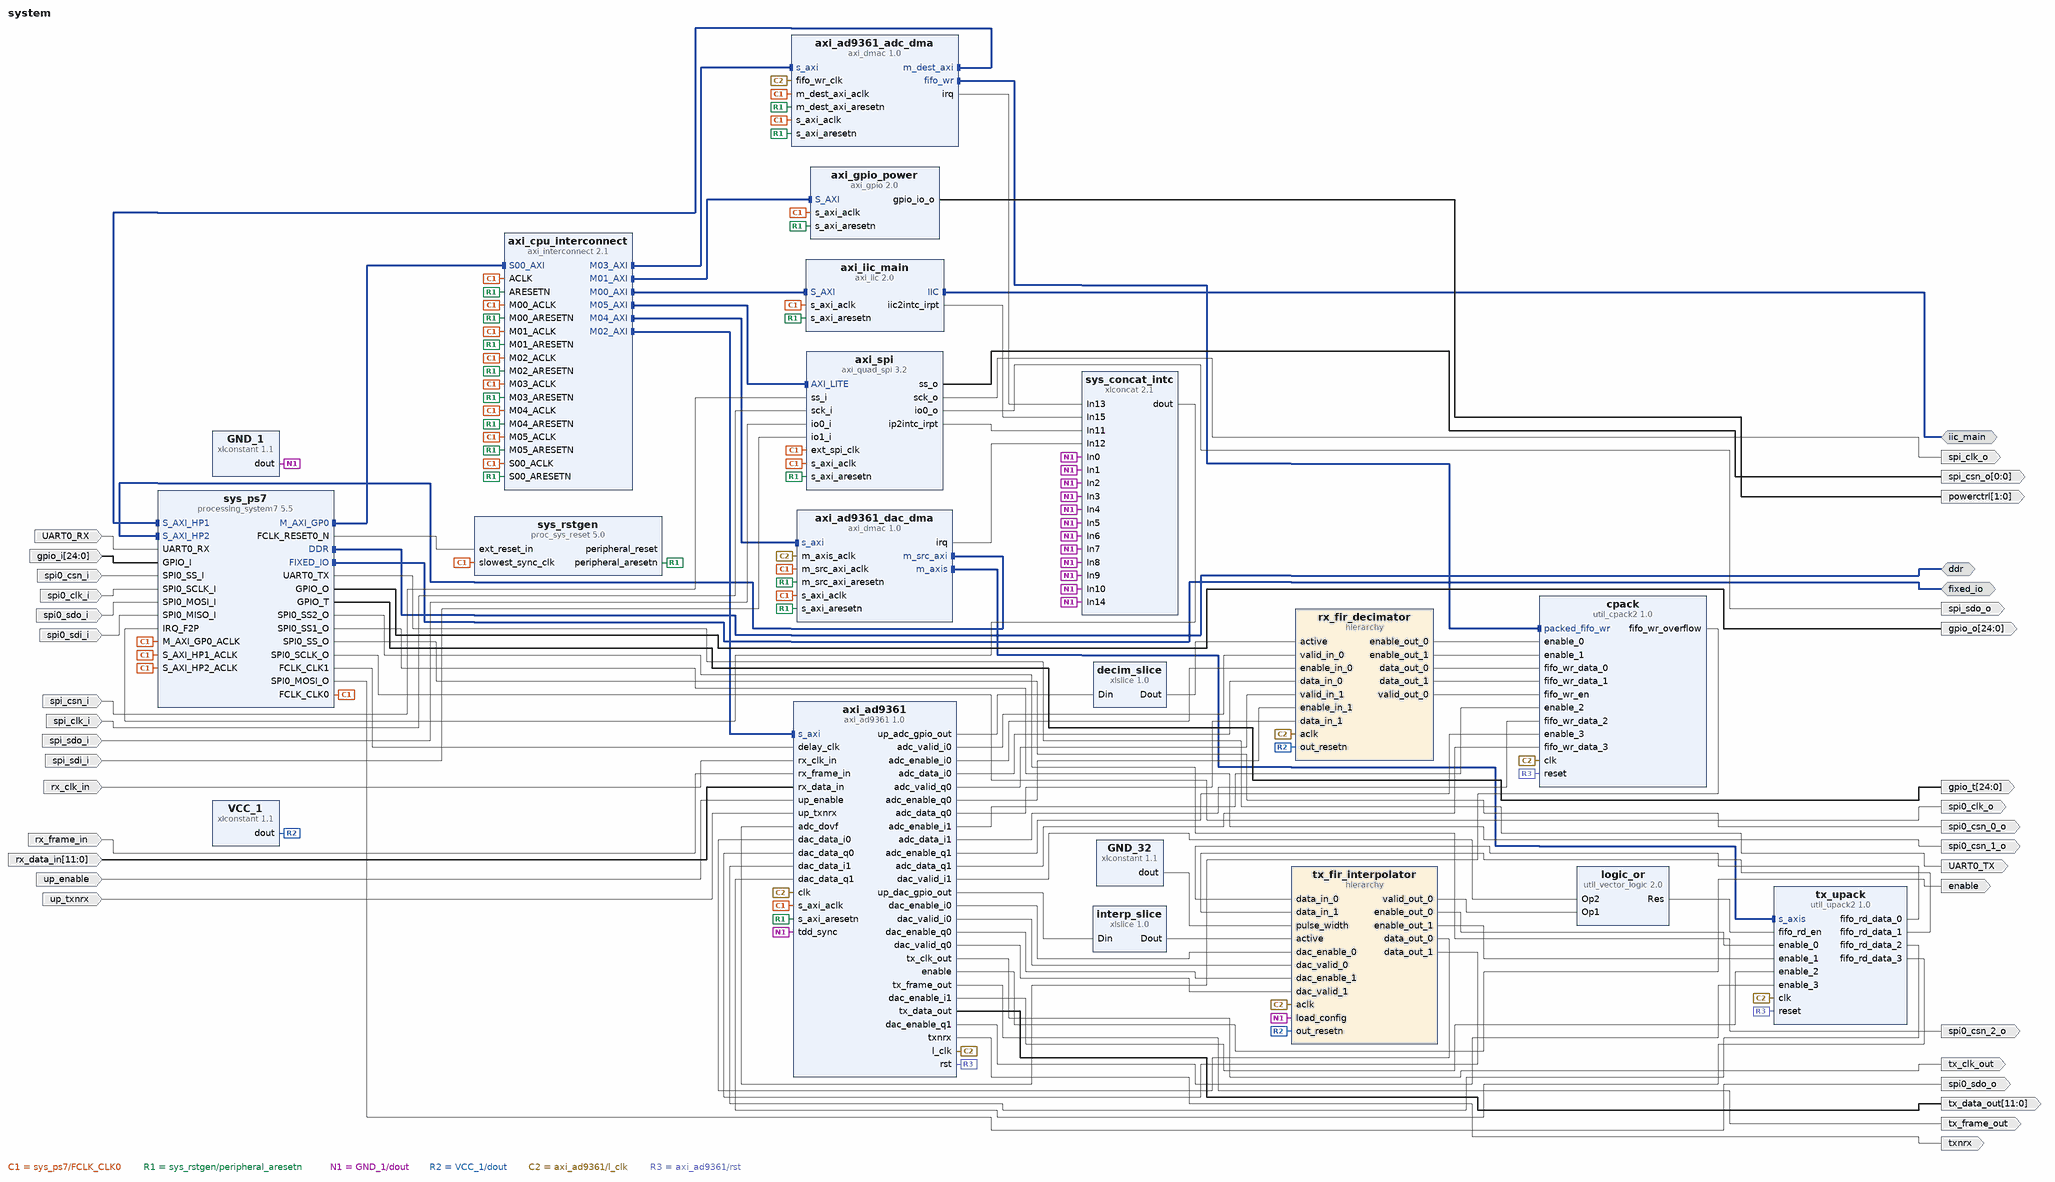
[diagram p0: block diagram of the top level]
# Vivado block design system, xc7z020clg400-2, Vivado 2019.1
create_bd_design system

create_bd_intf_port -mode Master -vlnv xilinx.com:interface:ddrx_rtl:1.0 ddr
create_bd_intf_port -mode Master -vlnv xilinx.com:display_processing_system7:fixedio_rtl:1.0 fixed_io
create_bd_intf_port -mode Master -vlnv xilinx.com:interface:iic_rtl:1.0 iic_main
create_bd_port -dir O UART0_TX
create_bd_port -dir I UART0_RX
create_bd_port -dir O spi0_csn_2_o
create_bd_port -dir O spi0_csn_1_o
create_bd_port -dir O spi0_csn_0_o
create_bd_port -dir I spi0_csn_i
create_bd_port -dir I spi0_clk_i
create_bd_port -dir O spi0_clk_o
create_bd_port -dir I spi0_sdo_i
create_bd_port -dir O spi0_sdo_o
create_bd_port -dir I spi0_sdi_i
create_bd_port -dir I -from 24 -to 0 gpio_i
create_bd_port -dir O -from 24 -to 0 gpio_o
create_bd_port -dir O -from 24 -to 0 gpio_t
create_bd_port -dir O -from 0 -to 0 spi_csn_o
create_bd_port -dir I spi_csn_i
create_bd_port -dir I spi_clk_i
create_bd_port -dir O spi_clk_o
create_bd_port -dir I spi_sdo_i
create_bd_port -dir O spi_sdo_o
create_bd_port -dir I spi_sdi_i
create_bd_port -dir I rx_clk_in
create_bd_port -dir I rx_frame_in
create_bd_port -dir I -from 11 -to 0 rx_data_in
create_bd_port -dir O tx_clk_out
create_bd_port -dir O tx_frame_out
create_bd_port -dir O -from 11 -to 0 tx_data_out
create_bd_port -dir O enable
create_bd_port -dir O txnrx
create_bd_port -dir I up_enable
create_bd_port -dir I up_txnrx
create_bd_port -dir O -from 1 -to 0 powerctrl

create_bd_cell -type ip -vlnv xilinx.com:ip:processing_system7:5.5 sys_ps7
set_property -dict [list \
  CONFIG.PCW_ENET0_ENET0_IO {MIO 16 .. 27} \
  CONFIG.PCW_ENET0_GRP_MDIO_ENABLE 1 \
  CONFIG.PCW_ENET0_GRP_MDIO_IO {MIO 52 .. 53} \
  CONFIG.PCW_ENET0_PERIPHERAL_ENABLE 1 \
  CONFIG.PCW_ENET0_RESET_ENABLE 1 \
  CONFIG.PCW_ENET0_RESET_IO {MIO 46} \
  CONFIG.PCW_ENET_RESET_ENABLE 1 \
  CONFIG.PCW_ENET_RESET_SELECT {Separate reset pins} \
  CONFIG.PCW_EN_CLK1_PORT 1 \
  CONFIG.PCW_EN_RST1_PORT 1 \
  CONFIG.PCW_FCLK_CLK1_BUF TRUE \
  CONFIG.PCW_FPGA0_PERIPHERAL_FREQMHZ 100.0 \
  CONFIG.PCW_FPGA1_PERIPHERAL_FREQMHZ 200.0 \
  CONFIG.PCW_FPGA_FCLK1_ENABLE 1 \
  CONFIG.PCW_GPIO_EMIO_GPIO_ENABLE 1 \
  CONFIG.PCW_GPIO_EMIO_GPIO_IO 25 \
  CONFIG.PCW_GPIO_EMIO_GPIO_WIDTH 25 \
  CONFIG.PCW_GPIO_MIO_GPIO_ENABLE 1 \
  CONFIG.PCW_GPIO_MIO_GPIO_IO MIO \
  CONFIG.PCW_I2C_RESET_ENABLE 1 \
  CONFIG.PCW_IRQ_F2P_INTR 1 \
  CONFIG.PCW_IRQ_F2P_MODE REVERSE \
  CONFIG.PCW_PRESET_BANK1_VOLTAGE {LVCMOS 1.8V} \
  CONFIG.PCW_QSPI_GRP_SINGLE_SS_ENABLE 1 \
  CONFIG.PCW_QSPI_GRP_SINGLE_SS_IO {MIO 1 .. 6} \
  CONFIG.PCW_QSPI_PERIPHERAL_ENABLE 1 \
  CONFIG.PCW_QSPI_QSPI_IO {MIO 1 .. 6} \
  CONFIG.PCW_SD0_GRP_CD_ENABLE 0 \
  CONFIG.PCW_SD0_GRP_WP_ENABLE 0 \
  CONFIG.PCW_SD0_PERIPHERAL_ENABLE 1 \
  CONFIG.PCW_SD0_SD0_IO {MIO 40 .. 45} \
  CONFIG.PCW_SDIO_PERIPHERAL_FREQMHZ 50 \
  CONFIG.PCW_SINGLE_QSPI_DATA_MODE x4 \
  CONFIG.PCW_SPI0_PERIPHERAL_ENABLE 1 \
  CONFIG.PCW_SPI0_SPI0_IO EMIO \
  CONFIG.PCW_UART0_BAUD_RATE 9600 \
  CONFIG.PCW_UART0_PERIPHERAL_ENABLE 1 \
  CONFIG.PCW_UART0_UART0_IO EMIO \
  CONFIG.PCW_UART1_PERIPHERAL_ENABLE 1 \
  CONFIG.PCW_UART1_UART1_IO {MIO 12 .. 13} \
  CONFIG.PCW_UART_PERIPHERAL_FREQMHZ 100 \
  CONFIG.PCW_UIPARAM_DDR_PARTNO {MT41J256M16 RE-125} \
  CONFIG.PCW_USB0_PERIPHERAL_ENABLE 1 \
  CONFIG.PCW_USB0_RESET_ENABLE 1 \
  CONFIG.PCW_USB0_RESET_IO {MIO 47} \
  CONFIG.PCW_USB0_USB0_IO {MIO 28 .. 39} \
  CONFIG.PCW_USB_RESET_ENABLE 1 \
  CONFIG.PCW_USB_RESET_SELECT {Share reset pin} \
  CONFIG.PCW_USE_FABRIC_INTERRUPT 1 \
  CONFIG.PCW_USE_S_AXI_HP1 1 \
  CONFIG.PCW_USE_S_AXI_HP2 1 \
] [get_bd_cells sys_ps7]
# 231 more settings of sys_ps7 are not shown: defaults, MIO pin electricals, DDR timing, and values the tool derives
create_bd_cell -type ip -vlnv xilinx.com:ip:xlconcat:2.1 sys_concat_intc
set_property -dict {CONFIG.NUM_PORTS 16} [get_bd_cells sys_concat_intc]
create_bd_cell -type ip -vlnv xilinx.com:ip:proc_sys_reset:5.0 sys_rstgen
set_property -dict {CONFIG.C_EXT_RST_WIDTH 1} [get_bd_cells sys_rstgen]
create_bd_cell -type ip -vlnv xilinx.com:ip:axi_quad_spi:3.2 axi_spi
set_property -dict {CONFIG.C_NUM_SS_BITS 1 CONFIG.C_SCK_RATIO 8 CONFIG.C_USE_STARTUP 0} [get_bd_cells axi_spi]
create_bd_cell -type ip -vlnv xilinx.com:ip:xlconstant:1.1 GND_1
set_property -dict {CONFIG.CONST_VAL 0 CONFIG.CONST_WIDTH 1} [get_bd_cells GND_1]
create_bd_cell -type ip -vlnv xilinx.com:ip:axi_iic:2.0 axi_iic_main
create_bd_cell -type ip -vlnv xilinx.com:ip:axi_interconnect:2.1 axi_cpu_interconnect
set_property -dict {CONFIG.NUM_MI 6} [get_bd_cells axi_cpu_interconnect]
create_bd_cell -type ip -vlnv xilinx.com:ip:axi_gpio:2.0 axi_gpio_power
set_property -dict {CONFIG.C_ALL_OUTPUTS 1 CONFIG.C_GPIO_WIDTH 2} [get_bd_cells axi_gpio_power]
create_bd_cell -type ip -vlnv analog.com:user:axi_ad9361:1.0 axi_ad9361
set_property -dict {CONFIG.ADC_INIT_DELAY 21 CONFIG.CMOS_OR_LVDS_N 1 CONFIG.ID 0 CONFIG.MODE_1R1T 0} [get_bd_cells axi_ad9361]
create_bd_cell -type ip -vlnv analog.com:user:axi_dmac:1.0 axi_ad9361_dac_dma
set_property -dict [list \
  CONFIG.AXI_SLICE_DEST false \
  CONFIG.AXI_SLICE_SRC false \
  CONFIG.CYCLIC true \
  CONFIG.DMA_2D_TRANSFER false \
  CONFIG.DMA_DATA_WIDTH_DEST 64 \
  CONFIG.DMA_TYPE_DEST 1 \
  CONFIG.DMA_TYPE_SRC 0 \
] [get_bd_cells axi_ad9361_dac_dma]
create_bd_cell -type hier tx_fir_interpolator
create_bd_cell -type ip -vlnv xilinx.com:ip:xlconstant:1.1 VCC_1
set_property -dict {CONFIG.CONST_VAL 1 CONFIG.CONST_WIDTH 1} [get_bd_cells VCC_1]
create_bd_cell -type ip -vlnv xilinx.com:ip:xlconstant:1.1 GND_32
set_property -dict {CONFIG.CONST_VAL 0 CONFIG.CONST_WIDTH 32} [get_bd_cells GND_32]
create_bd_cell -type ip -vlnv xilinx.com:ip:xlslice:1.0 interp_slice
create_bd_cell -type ip -vlnv analog.com:user:util_upack2:1.0 tx_upack
create_bd_cell -type ip -vlnv analog.com:user:axi_dmac:1.0 axi_ad9361_adc_dma
set_property -dict [list \
  CONFIG.AXI_SLICE_DEST false \
  CONFIG.AXI_SLICE_SRC false \
  CONFIG.CYCLIC false \
  CONFIG.DMA_2D_TRANSFER false \
  CONFIG.DMA_DATA_WIDTH_SRC 64 \
  CONFIG.DMA_TYPE_DEST 0 \
  CONFIG.DMA_TYPE_SRC 2 \
  CONFIG.SYNC_TRANSFER_START false \
] [get_bd_cells axi_ad9361_adc_dma]
create_bd_cell -type hier rx_fir_decimator
create_bd_cell -type ip -vlnv xilinx.com:ip:xlslice:1.0 decim_slice
create_bd_cell -type ip -vlnv analog.com:user:util_cpack2:1.0 cpack
create_bd_cell -type ip -vlnv xilinx.com:ip:util_vector_logic:2.0 logic_or
set_property -dict {CONFIG.C_OPERATION or CONFIG.C_SIZE 1} [get_bd_cells logic_or]

# ---- hierarchy /tx_fir_interpolator ----
current_bd_instance /tx_fir_interpolator
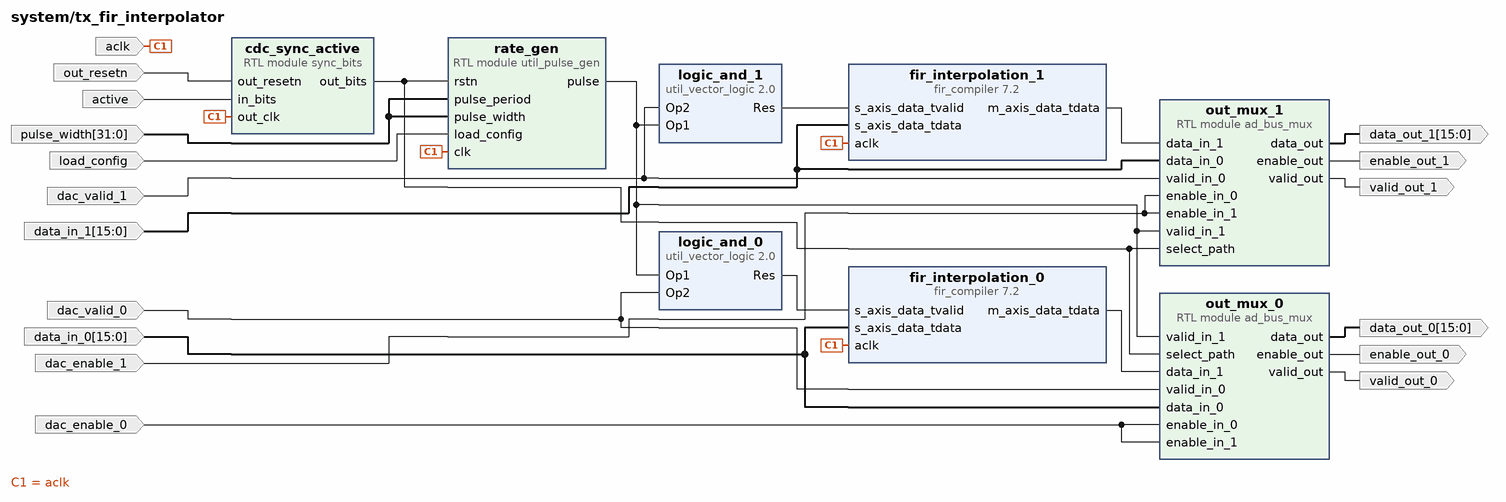
[diagram p1: block diagram inside /tx_fir_interpolator]
create_bd_pin -dir I aclk
create_bd_pin -dir I active
create_bd_pin -dir I -type rst out_resetn
create_bd_pin -dir I -from 31 -to 0 pulse_width
create_bd_pin -dir I load_config
create_bd_pin -dir I dac_valid_0
create_bd_pin -dir I dac_enable_0
create_bd_pin -dir O valid_out_0
create_bd_pin -dir O enable_out_0
create_bd_pin -dir I -from 15 -to 0 data_in_0
create_bd_pin -dir O -from 15 -to 0 data_out_0
create_bd_pin -dir I dac_valid_1
create_bd_pin -dir I dac_enable_1
create_bd_pin -dir O valid_out_1
create_bd_pin -dir O enable_out_1
create_bd_pin -dir I -from 15 -to 0 data_in_1
create_bd_pin -dir O -from 15 -to 0 data_out_1

create_bd_cell -type module -reference sync_bits cdc_sync_active
create_bd_cell -type module -reference util_pulse_gen rate_gen
set_property -dict {CONFIG.PULSE_PERIOD 7 CONFIG.PULSE_WIDTH 1} [get_bd_cells rate_gen]
create_bd_cell -type ip -vlnv xilinx.com:ip:fir_compiler:7.2 fir_interpolation_0
set_property -dict [list \
  CONFIG.Clock_Frequency 61.44 \
  CONFIG.CoefficientSource COE_File \
  CONFIG.Coefficient_File ../../../../../../../../library/util_fir_int/coefile_int.coe \
  CONFIG.Coefficient_Fractional_Bits 0 \
  CONFIG.Coefficient_Sets 1 \
  CONFIG.Coefficient_Sign Signed \
  CONFIG.Coefficient_Structure Inferred \
  CONFIG.Coefficient_Width 16 \
  CONFIG.ColumnConfig 9 \
  CONFIG.Data_Fractional_Bits 15 \
  CONFIG.Decimation_Rate 1 \
  CONFIG.Filter_Architecture Systolic_Multiply_Accumulate \
  CONFIG.Filter_Type Interpolation \
  CONFIG.Interpolation_Rate 8 \
  CONFIG.Number_Channels 1 \
  CONFIG.Number_Paths 1 \
  CONFIG.Output_Rounding_Mode Symmetric_Rounding_to_Zero \
  CONFIG.Output_Width 16 \
  CONFIG.Quantization Integer_Coefficients \
  CONFIG.RateSpecification Frequency_Specification \
  CONFIG.Sample_Frequency 7.68 \
  CONFIG.Zero_Pack_Factor 1 \
] [get_bd_cells fir_interpolation_0]
create_bd_cell -type ip -vlnv xilinx.com:ip:util_vector_logic:2.0 logic_and_0
set_property -dict {CONFIG.C_SIZE 1} [get_bd_cells logic_and_0]
create_bd_cell -type module -reference ad_bus_mux out_mux_0
set_property -dict {CONFIG.DATA_WIDTH 16} [get_bd_cells out_mux_0]
create_bd_cell -type ip -vlnv xilinx.com:ip:fir_compiler:7.2 fir_interpolation_1
set_property -dict [list \
  CONFIG.Clock_Frequency 61.44 \
  CONFIG.CoefficientSource COE_File \
  CONFIG.Coefficient_File ../../../../../../../../library/util_fir_int/coefile_int.coe \
  CONFIG.Coefficient_Fractional_Bits 0 \
  CONFIG.Coefficient_Sets 1 \
  CONFIG.Coefficient_Sign Signed \
  CONFIG.Coefficient_Structure Inferred \
  CONFIG.Coefficient_Width 16 \
  CONFIG.ColumnConfig 9 \
  CONFIG.Data_Fractional_Bits 15 \
  CONFIG.Decimation_Rate 1 \
  CONFIG.Filter_Architecture Systolic_Multiply_Accumulate \
  CONFIG.Filter_Type Interpolation \
  CONFIG.Interpolation_Rate 8 \
  CONFIG.Number_Channels 1 \
  CONFIG.Number_Paths 1 \
  CONFIG.Output_Rounding_Mode Symmetric_Rounding_to_Zero \
  CONFIG.Output_Width 16 \
  CONFIG.Quantization Integer_Coefficients \
  CONFIG.RateSpecification Frequency_Specification \
  CONFIG.Sample_Frequency 7.68 \
  CONFIG.Zero_Pack_Factor 1 \
] [get_bd_cells fir_interpolation_1]
create_bd_cell -type ip -vlnv xilinx.com:ip:util_vector_logic:2.0 logic_and_1
set_property -dict {CONFIG.C_SIZE 1} [get_bd_cells logic_and_1]
create_bd_cell -type module -reference ad_bus_mux out_mux_1
set_property -dict {CONFIG.DATA_WIDTH 16} [get_bd_cells out_mux_1]

# ---- hierarchy /rx_fir_decimator ----
current_bd_instance /rx_fir_decimator
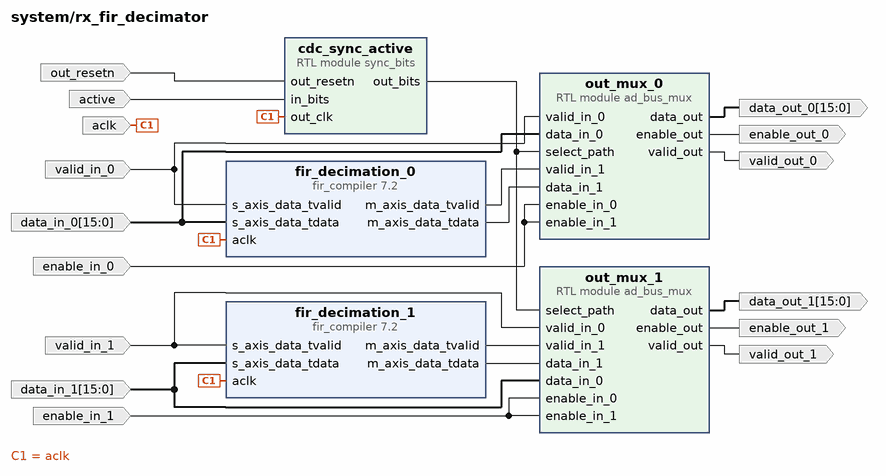
[diagram p2: block diagram inside /rx_fir_decimator]
create_bd_pin -dir I aclk
create_bd_pin -dir I active
create_bd_pin -dir I -type rst out_resetn
create_bd_pin -dir I valid_in_0
create_bd_pin -dir I enable_in_0
create_bd_pin -dir O valid_out_0
create_bd_pin -dir O enable_out_0
create_bd_pin -dir I -from 15 -to 0 data_in_0
create_bd_pin -dir O -from 15 -to 0 data_out_0
create_bd_pin -dir I valid_in_1
create_bd_pin -dir I enable_in_1
create_bd_pin -dir O valid_out_1
create_bd_pin -dir O enable_out_1
create_bd_pin -dir I -from 15 -to 0 data_in_1
create_bd_pin -dir O -from 15 -to 0 data_out_1

create_bd_cell -type module -reference sync_bits cdc_sync_active
create_bd_cell -type ip -vlnv xilinx.com:ip:fir_compiler:7.2 fir_decimation_0
set_property -dict [list \
  CONFIG.Clock_Frequency 61.44 \
  CONFIG.CoefficientSource COE_File \
  CONFIG.Coefficient_File ../../../../../../../../library/util_fir_int/coefile_int.coe \
  CONFIG.Coefficient_Fractional_Bits 0 \
  CONFIG.Coefficient_Sets 1 \
  CONFIG.Coefficient_Sign Signed \
  CONFIG.Coefficient_Structure Inferred \
  CONFIG.Coefficient_Width 16 \
  CONFIG.ColumnConfig 9 \
  CONFIG.Data_Fractional_Bits 15 \
  CONFIG.Decimation_Rate 8 \
  CONFIG.Filter_Architecture Systolic_Multiply_Accumulate \
  CONFIG.Filter_Type Decimation \
  CONFIG.Interpolation_Rate 1 \
  CONFIG.Number_Channels 1 \
  CONFIG.Number_Paths 1 \
  CONFIG.Output_Rounding_Mode Symmetric_Rounding_to_Zero \
  CONFIG.Output_Width 16 \
  CONFIG.Quantization Integer_Coefficients \
  CONFIG.RateSpecification Frequency_Specification \
  CONFIG.Sample_Frequency 61.44 \
  CONFIG.Zero_Pack_Factor 1 \
] [get_bd_cells fir_decimation_0]
create_bd_cell -type module -reference ad_bus_mux out_mux_0
set_property -dict {CONFIG.DATA_WIDTH 16} [get_bd_cells out_mux_0]
create_bd_cell -type ip -vlnv xilinx.com:ip:fir_compiler:7.2 fir_decimation_1
set_property -dict [list \
  CONFIG.Clock_Frequency 61.44 \
  CONFIG.CoefficientSource COE_File \
  CONFIG.Coefficient_File ../../../../../../../../library/util_fir_int/coefile_int.coe \
  CONFIG.Coefficient_Fractional_Bits 0 \
  CONFIG.Coefficient_Sets 1 \
  CONFIG.Coefficient_Sign Signed \
  CONFIG.Coefficient_Structure Inferred \
  CONFIG.Coefficient_Width 16 \
  CONFIG.ColumnConfig 9 \
  CONFIG.Data_Fractional_Bits 15 \
  CONFIG.Decimation_Rate 8 \
  CONFIG.Filter_Architecture Systolic_Multiply_Accumulate \
  CONFIG.Filter_Type Decimation \
  CONFIG.Interpolation_Rate 1 \
  CONFIG.Number_Channels 1 \
  CONFIG.Number_Paths 1 \
  CONFIG.Output_Rounding_Mode Symmetric_Rounding_to_Zero \
  CONFIG.Output_Width 16 \
  CONFIG.Quantization Integer_Coefficients \
  CONFIG.RateSpecification Frequency_Specification \
  CONFIG.Sample_Frequency 61.44 \
  CONFIG.Zero_Pack_Factor 1 \
] [get_bd_cells fir_decimation_1]
create_bd_cell -type module -reference ad_bus_mux out_mux_1
set_property -dict {CONFIG.DATA_WIDTH 16} [get_bd_cells out_mux_1]

# ---- connections ----

current_bd_instance /tx_fir_interpolator
connect_bd_net [get_bd_pins aclk] \
  [get_bd_pins cdc_sync_active/out_clk] [get_bd_pins rate_gen/clk] [get_bd_pins fir_interpolation_0/aclk] \
  [get_bd_pins fir_interpolation_1/aclk]
connect_bd_net [get_bd_pins out_resetn] [get_bd_pins cdc_sync_active/out_resetn]
connect_bd_net [get_bd_pins active] [get_bd_pins cdc_sync_active/in_bits]
connect_bd_net [get_bd_pins pulse_width] [get_bd_pins rate_gen/pulse_width] [get_bd_pins rate_gen/pulse_period]
connect_bd_net [get_bd_pins load_config] [get_bd_pins rate_gen/load_config]
connect_bd_net [get_bd_pins cdc_sync_active/out_bits] \
  [get_bd_pins rate_gen/rstn] [get_bd_pins out_mux_0/select_path] [get_bd_pins out_mux_1/select_path]
connect_bd_net [get_bd_pins rate_gen/pulse] \
  [get_bd_pins logic_and_0/Op1] [get_bd_pins out_mux_0/valid_in_1] [get_bd_pins logic_and_1/Op1] \
  [get_bd_pins out_mux_1/valid_in_1]
connect_bd_net -net dac_valid_0_1 [get_bd_pins dac_valid_0] [get_bd_pins logic_and_0/Op2] [get_bd_pins out_mux_0/valid_in_0]
connect_bd_net [get_bd_pins logic_and_0/Res] [get_bd_pins fir_interpolation_0/s_axis_data_tvalid]
connect_bd_net -net data_in_0_1 [get_bd_pins data_in_0] [get_bd_pins fir_interpolation_0/s_axis_data_tdata] [get_bd_pins out_mux_0/data_in_0]
connect_bd_net -net dac_enable_0_1 [get_bd_pins dac_enable_0] [get_bd_pins out_mux_0/enable_in_1] [get_bd_pins out_mux_0/enable_in_0]
connect_bd_net [get_bd_pins fir_interpolation_0/m_axis_data_tdata] [get_bd_pins out_mux_0/data_in_1]
connect_bd_net [get_bd_pins out_mux_0/valid_out] [get_bd_pins valid_out_0]
connect_bd_net [get_bd_pins out_mux_0/enable_out] [get_bd_pins enable_out_0]
connect_bd_net [get_bd_pins out_mux_0/data_out] [get_bd_pins data_out_0]
connect_bd_net -net dac_valid_1_1 [get_bd_pins dac_valid_1] [get_bd_pins logic_and_1/Op2] [get_bd_pins out_mux_1/valid_in_0]
connect_bd_net [get_bd_pins logic_and_1/Res] [get_bd_pins fir_interpolation_1/s_axis_data_tvalid]
connect_bd_net -net data_in_1_1 [get_bd_pins data_in_1] [get_bd_pins fir_interpolation_1/s_axis_data_tdata] [get_bd_pins out_mux_1/data_in_0]
connect_bd_net -net dac_enable_1_1 [get_bd_pins dac_enable_1] [get_bd_pins out_mux_1/enable_in_1] [get_bd_pins out_mux_1/enable_in_0]
connect_bd_net [get_bd_pins fir_interpolation_1/m_axis_data_tdata] [get_bd_pins out_mux_1/data_in_1]
connect_bd_net [get_bd_pins out_mux_1/valid_out] [get_bd_pins valid_out_1]
connect_bd_net [get_bd_pins out_mux_1/enable_out] [get_bd_pins enable_out_1]
connect_bd_net [get_bd_pins out_mux_1/data_out] [get_bd_pins data_out_1]

current_bd_instance /rx_fir_decimator
connect_bd_net [get_bd_pins aclk] [get_bd_pins cdc_sync_active/out_clk] [get_bd_pins fir_decimation_0/aclk] [get_bd_pins fir_decimation_1/aclk]
connect_bd_net [get_bd_pins out_resetn] [get_bd_pins cdc_sync_active/out_resetn]
connect_bd_net [get_bd_pins active] [get_bd_pins cdc_sync_active/in_bits]
connect_bd_net -net valid_in_0_1 [get_bd_pins valid_in_0] [get_bd_pins out_mux_0/valid_in_0] [get_bd_pins fir_decimation_0/s_axis_data_tvalid]
connect_bd_net -net enable_in_0_1 [get_bd_pins enable_in_0] [get_bd_pins out_mux_0/enable_in_0] [get_bd_pins out_mux_0/enable_in_1]
connect_bd_net -net data_in_0_1 [get_bd_pins data_in_0] [get_bd_pins out_mux_0/data_in_0] [get_bd_pins fir_decimation_0/s_axis_data_tdata]
connect_bd_net [get_bd_pins fir_decimation_0/m_axis_data_tvalid] [get_bd_pins out_mux_0/valid_in_1]
connect_bd_net [get_bd_pins fir_decimation_0/m_axis_data_tdata] [get_bd_pins out_mux_0/data_in_1]
connect_bd_net [get_bd_pins out_mux_0/valid_out] [get_bd_pins valid_out_0]
connect_bd_net [get_bd_pins out_mux_0/enable_out] [get_bd_pins enable_out_0]
connect_bd_net [get_bd_pins out_mux_0/data_out] [get_bd_pins data_out_0]
connect_bd_net [get_bd_pins cdc_sync_active/out_bits] [get_bd_pins out_mux_0/select_path] [get_bd_pins out_mux_1/select_path]
connect_bd_net -net valid_in_1_1 [get_bd_pins valid_in_1] [get_bd_pins out_mux_1/valid_in_0] [get_bd_pins fir_decimation_1/s_axis_data_tvalid]
connect_bd_net -net enable_in_1_1 [get_bd_pins enable_in_1] [get_bd_pins out_mux_1/enable_in_0] [get_bd_pins out_mux_1/enable_in_1]
connect_bd_net -net data_in_1_1 [get_bd_pins data_in_1] [get_bd_pins out_mux_1/data_in_0] [get_bd_pins fir_decimation_1/s_axis_data_tdata]
connect_bd_net [get_bd_pins fir_decimation_1/m_axis_data_tvalid] [get_bd_pins out_mux_1/valid_in_1]
connect_bd_net [get_bd_pins fir_decimation_1/m_axis_data_tdata] [get_bd_pins out_mux_1/data_in_1]
connect_bd_net [get_bd_pins out_mux_1/valid_out] [get_bd_pins valid_out_1]
connect_bd_net [get_bd_pins out_mux_1/enable_out] [get_bd_pins enable_out_1]
connect_bd_net [get_bd_pins out_mux_1/data_out] [get_bd_pins data_out_1]

current_bd_instance /
connect_bd_intf_net [get_bd_intf_ports ddr] [get_bd_intf_pins sys_ps7/DDR]
connect_bd_intf_net [get_bd_intf_ports iic_main] [get_bd_intf_pins axi_iic_main/IIC]
connect_bd_intf_net [get_bd_intf_ports fixed_io] [get_bd_intf_pins sys_ps7/FIXED_IO]
connect_bd_intf_net [get_bd_intf_pins axi_ad9361_adc_dma/fifo_wr] [get_bd_intf_pins cpack/packed_fifo_wr]
connect_bd_intf_net [get_bd_intf_pins axi_cpu_interconnect/S00_AXI] [get_bd_intf_pins sys_ps7/M_AXI_GP0]
connect_bd_intf_net [get_bd_intf_pins axi_cpu_interconnect/M00_AXI] [get_bd_intf_pins axi_iic_main/S_AXI]
connect_bd_intf_net [get_bd_intf_pins axi_cpu_interconnect/M05_AXI] [get_bd_intf_pins axi_spi/AXI_LITE]
connect_bd_intf_net [get_bd_intf_pins tx_upack/s_axis] [get_bd_intf_pins axi_ad9361_dac_dma/m_axis]
connect_bd_intf_net [get_bd_intf_pins axi_cpu_interconnect/M02_AXI] [get_bd_intf_pins axi_ad9361/s_axi]
connect_bd_intf_net [get_bd_intf_pins axi_cpu_interconnect/M04_AXI] [get_bd_intf_pins axi_ad9361_dac_dma/s_axi]
connect_bd_intf_net [get_bd_intf_pins axi_ad9361_adc_dma/m_dest_axi] [get_bd_intf_pins sys_ps7/S_AXI_HP1]
connect_bd_intf_net [get_bd_intf_pins axi_cpu_interconnect/M01_AXI] [get_bd_intf_pins axi_gpio_power/S_AXI]
connect_bd_intf_net [get_bd_intf_pins axi_ad9361_dac_dma/m_src_axi] [get_bd_intf_pins sys_ps7/S_AXI_HP2]
connect_bd_intf_net [get_bd_intf_pins axi_cpu_interconnect/M03_AXI] [get_bd_intf_pins axi_ad9361_adc_dma/s_axi]
connect_bd_net [get_bd_pins sys_ps7/UART0_TX] [get_bd_ports UART0_TX]
connect_bd_net [get_bd_ports UART0_RX] [get_bd_pins sys_ps7/UART0_RX]
connect_bd_net -net sys_cpu_clk [get_bd_pins sys_ps7/FCLK_CLK0] \
  [get_bd_pins sys_rstgen/slowest_sync_clk] [get_bd_pins axi_spi/ext_spi_clk] [get_bd_pins sys_ps7/M_AXI_GP0_ACLK] \
  [get_bd_pins axi_cpu_interconnect/ACLK] [get_bd_pins axi_cpu_interconnect/S00_ACLK] \
  [get_bd_pins axi_cpu_interconnect/M00_ACLK] [get_bd_pins axi_iic_main/s_axi_aclk] \
  [get_bd_pins axi_cpu_interconnect/M01_ACLK] [get_bd_pins axi_gpio_power/s_axi_aclk] \
  [get_bd_pins axi_cpu_interconnect/M02_ACLK] [get_bd_pins axi_ad9361/s_axi_aclk] [get_bd_pins axi_cpu_interconnect/M03_ACLK] \
  [get_bd_pins axi_ad9361_adc_dma/s_axi_aclk] [get_bd_pins axi_cpu_interconnect/M04_ACLK] \
  [get_bd_pins axi_ad9361_dac_dma/s_axi_aclk] [get_bd_pins axi_cpu_interconnect/M05_ACLK] [get_bd_pins axi_spi/s_axi_aclk] \
  [get_bd_pins sys_ps7/S_AXI_HP1_ACLK] [get_bd_pins sys_ps7/S_AXI_HP2_ACLK] [get_bd_pins axi_ad9361_dac_dma/m_src_axi_aclk] \
  [get_bd_pins axi_ad9361_adc_dma/m_dest_axi_aclk]
connect_bd_net -net sys_200m_clk [get_bd_pins sys_ps7/FCLK_CLK1] [get_bd_pins axi_ad9361/delay_clk]
# net sys_cpu_reset has one end: sys_rstgen/peripheral_reset
connect_bd_net -net sys_cpu_resetn [get_bd_pins sys_rstgen/peripheral_aresetn] \
  [get_bd_pins axi_cpu_interconnect/ARESETN] [get_bd_pins axi_cpu_interconnect/S00_ARESETN] \
  [get_bd_pins axi_cpu_interconnect/M00_ARESETN] [get_bd_pins axi_iic_main/s_axi_aresetn] \
  [get_bd_pins axi_cpu_interconnect/M01_ARESETN] [get_bd_pins axi_gpio_power/s_axi_aresetn] \
  [get_bd_pins axi_cpu_interconnect/M02_ARESETN] [get_bd_pins axi_ad9361/s_axi_aresetn] \
  [get_bd_pins axi_cpu_interconnect/M03_ARESETN] [get_bd_pins axi_ad9361_adc_dma/s_axi_aresetn] \
  [get_bd_pins axi_cpu_interconnect/M04_ARESETN] [get_bd_pins axi_ad9361_dac_dma/s_axi_aresetn] \
  [get_bd_pins axi_cpu_interconnect/M05_ARESETN] [get_bd_pins axi_spi/s_axi_aresetn] \
  [get_bd_pins axi_ad9361_adc_dma/m_dest_axi_aresetn] [get_bd_pins axi_ad9361_dac_dma/m_src_axi_aresetn]
connect_bd_net [get_bd_pins sys_ps7/FCLK_RESET0_N] [get_bd_pins sys_rstgen/ext_reset_in]
connect_bd_net [get_bd_ports gpio_i] [get_bd_pins sys_ps7/GPIO_I]
connect_bd_net [get_bd_pins sys_ps7/GPIO_O] [get_bd_ports gpio_o]
connect_bd_net [get_bd_pins sys_ps7/GPIO_T] [get_bd_ports gpio_t]
connect_bd_net [get_bd_pins sys_ps7/SPI0_SS2_O] [get_bd_ports spi0_csn_2_o]
connect_bd_net [get_bd_pins sys_ps7/SPI0_SS1_O] [get_bd_ports spi0_csn_1_o]
connect_bd_net [get_bd_pins sys_ps7/SPI0_SS_O] [get_bd_ports spi0_csn_0_o]
connect_bd_net [get_bd_ports spi0_csn_i] [get_bd_pins sys_ps7/SPI0_SS_I]
connect_bd_net [get_bd_ports spi0_clk_i] [get_bd_pins sys_ps7/SPI0_SCLK_I]
connect_bd_net [get_bd_pins sys_ps7/SPI0_SCLK_O] [get_bd_ports spi0_clk_o]
connect_bd_net [get_bd_ports spi0_sdo_i] [get_bd_pins sys_ps7/SPI0_MOSI_I]
connect_bd_net [get_bd_pins sys_ps7/SPI0_MOSI_O] [get_bd_ports spi0_sdo_o]
connect_bd_net [get_bd_ports spi0_sdi_i] [get_bd_pins sys_ps7/SPI0_MISO_I]
connect_bd_net [get_bd_ports spi_csn_i] [get_bd_pins axi_spi/ss_i]
connect_bd_net [get_bd_pins axi_spi/ss_o] [get_bd_ports spi_csn_o]
connect_bd_net [get_bd_ports spi_clk_i] [get_bd_pins axi_spi/sck_i]
connect_bd_net [get_bd_pins axi_spi/sck_o] [get_bd_ports spi_clk_o]
connect_bd_net [get_bd_ports spi_sdo_i] [get_bd_pins axi_spi/io0_i]
connect_bd_net [get_bd_pins axi_spi/io0_o] [get_bd_ports spi_sdo_o]
connect_bd_net [get_bd_ports spi_sdi_i] [get_bd_pins axi_spi/io1_i]
connect_bd_net [get_bd_pins sys_concat_intc/dout] [get_bd_pins sys_ps7/IRQ_F2P]
connect_bd_net [get_bd_pins GND_1/dout] \
  [get_bd_pins sys_concat_intc/In14] [get_bd_pins sys_concat_intc/In10] [get_bd_pins sys_concat_intc/In9] \
  [get_bd_pins sys_concat_intc/In8] [get_bd_pins sys_concat_intc/In7] [get_bd_pins sys_concat_intc/In6] \
  [get_bd_pins sys_concat_intc/In5] [get_bd_pins sys_concat_intc/In4] [get_bd_pins sys_concat_intc/In3] \
  [get_bd_pins sys_concat_intc/In2] [get_bd_pins sys_concat_intc/In1] [get_bd_pins sys_concat_intc/In0] \
  [get_bd_pins tx_fir_interpolator/load_config] [get_bd_pins axi_ad9361/tdd_sync]
connect_bd_net [get_bd_pins axi_iic_main/iic2intc_irpt] [get_bd_pins sys_concat_intc/In15]
connect_bd_net [get_bd_pins VCC_1/dout] [get_bd_pins tx_fir_interpolator/out_resetn] [get_bd_pins rx_fir_decimator/out_resetn]
connect_bd_net [get_bd_pins GND_32/dout] [get_bd_pins tx_fir_interpolator/pulse_width]
connect_bd_net [get_bd_ports rx_clk_in] [get_bd_pins axi_ad9361/rx_clk_in]
connect_bd_net [get_bd_ports rx_frame_in] [get_bd_pins axi_ad9361/rx_frame_in]
connect_bd_net [get_bd_ports rx_data_in] [get_bd_pins axi_ad9361/rx_data_in]
connect_bd_net [get_bd_pins axi_ad9361/tx_clk_out] [get_bd_ports tx_clk_out]
connect_bd_net [get_bd_pins axi_ad9361/tx_frame_out] [get_bd_ports tx_frame_out]
connect_bd_net [get_bd_pins axi_ad9361/tx_data_out] [get_bd_ports tx_data_out]
connect_bd_net [get_bd_pins axi_ad9361/enable] [get_bd_ports enable]
connect_bd_net [get_bd_pins axi_ad9361/txnrx] [get_bd_ports txnrx]
connect_bd_net [get_bd_ports up_enable] [get_bd_pins axi_ad9361/up_enable]
connect_bd_net [get_bd_ports up_txnrx] [get_bd_pins axi_ad9361/up_txnrx]
connect_bd_net [get_bd_pins axi_ad9361/l_clk] \
  [get_bd_pins axi_ad9361/clk] [get_bd_pins rx_fir_decimator/aclk] [get_bd_pins cpack/clk] \
  [get_bd_pins tx_fir_interpolator/aclk] [get_bd_pins tx_upack/clk] [get_bd_pins axi_ad9361_adc_dma/fifo_wr_clk] \
  [get_bd_pins axi_ad9361_dac_dma/m_axis_aclk]
connect_bd_net [get_bd_pins axi_ad9361/adc_valid_i0] [get_bd_pins rx_fir_decimator/valid_in_0]
connect_bd_net [get_bd_pins axi_ad9361/adc_enable_i0] [get_bd_pins rx_fir_decimator/enable_in_0]
connect_bd_net [get_bd_pins axi_ad9361/adc_data_i0] [get_bd_pins rx_fir_decimator/data_in_0]
connect_bd_net [get_bd_pins axi_ad9361/adc_valid_q0] [get_bd_pins rx_fir_decimator/valid_in_1]
connect_bd_net [get_bd_pins axi_ad9361/adc_enable_q0] [get_bd_pins rx_fir_decimator/enable_in_1]
connect_bd_net [get_bd_pins axi_ad9361/adc_data_q0] [get_bd_pins rx_fir_decimator/data_in_1]
connect_bd_net [get_bd_pins axi_ad9361/rst] [get_bd_pins cpack/reset] [get_bd_pins tx_upack/reset]
connect_bd_net [get_bd_pins axi_ad9361/adc_enable_i1] [get_bd_pins cpack/enable_2]
connect_bd_net [get_bd_pins axi_ad9361/adc_data_i1] [get_bd_pins cpack/fifo_wr_data_2]
connect_bd_net [get_bd_pins axi_ad9361/adc_enable_q1] [get_bd_pins cpack/enable_3]
connect_bd_net [get_bd_pins axi_ad9361/adc_data_q1] [get_bd_pins cpack/fifo_wr_data_3]
connect_bd_net [get_bd_pins rx_fir_decimator/enable_out_0] [get_bd_pins cpack/enable_0]
connect_bd_net [get_bd_pins rx_fir_decimator/enable_out_1] [get_bd_pins cpack/enable_1]
connect_bd_net [get_bd_pins rx_fir_decimator/data_out_0] [get_bd_pins cpack/fifo_wr_data_0]
connect_bd_net [get_bd_pins rx_fir_decimator/data_out_1] [get_bd_pins cpack/fifo_wr_data_1]
connect_bd_net [get_bd_pins rx_fir_decimator/valid_out_0] [get_bd_pins cpack/fifo_wr_en]
connect_bd_net [get_bd_pins axi_ad9361/up_adc_gpio_out] [get_bd_pins decim_slice/Din]
connect_bd_net -net active_1 [get_bd_pins decim_slice/Dout] [get_bd_pins rx_fir_decimator/active]
connect_bd_net [get_bd_pins axi_ad9361/dac_enable_i0] [get_bd_pins tx_fir_interpolator/dac_enable_0]
connect_bd_net [get_bd_pins axi_ad9361/dac_valid_i0] [get_bd_pins tx_fir_interpolator/dac_valid_0]
connect_bd_net [get_bd_pins tx_fir_interpolator/data_out_0] [get_bd_pins axi_ad9361/dac_data_i0]
connect_bd_net [get_bd_pins axi_ad9361/dac_enable_q0] [get_bd_pins tx_fir_interpolator/dac_enable_1]
connect_bd_net [get_bd_pins axi_ad9361/dac_valid_q0] [get_bd_pins tx_fir_interpolator/dac_valid_1]
connect_bd_net [get_bd_pins tx_fir_interpolator/data_out_1] [get_bd_pins axi_ad9361/dac_data_q0]
connect_bd_net [get_bd_pins tx_upack/fifo_rd_data_0] [get_bd_pins tx_fir_interpolator/data_in_0]
connect_bd_net [get_bd_pins tx_fir_interpolator/enable_out_0] [get_bd_pins tx_upack/enable_0]
connect_bd_net [get_bd_pins tx_upack/fifo_rd_data_1] [get_bd_pins tx_fir_interpolator/data_in_1]
connect_bd_net [get_bd_pins tx_fir_interpolator/enable_out_1] [get_bd_pins tx_upack/enable_1]
connect_bd_net [get_bd_pins axi_ad9361/dac_enable_i1] [get_bd_pins tx_upack/enable_2]
connect_bd_net [get_bd_pins tx_upack/fifo_rd_data_2] [get_bd_pins axi_ad9361/dac_data_i1]
connect_bd_net [get_bd_pins axi_ad9361/dac_enable_q1] [get_bd_pins tx_upack/enable_3]
connect_bd_net [get_bd_pins tx_upack/fifo_rd_data_3] [get_bd_pins axi_ad9361/dac_data_q1]
connect_bd_net [get_bd_pins tx_fir_interpolator/valid_out_0] [get_bd_pins logic_or/Op1]
connect_bd_net [get_bd_pins axi_ad9361/dac_valid_i1] [get_bd_pins logic_or/Op2]
connect_bd_net [get_bd_pins logic_or/Res] [get_bd_pins tx_upack/fifo_rd_en]
connect_bd_net [get_bd_pins axi_ad9361/up_dac_gpio_out] [get_bd_pins interp_slice/Din]
connect_bd_net -net active_2 [get_bd_pins interp_slice/Dout] [get_bd_pins tx_fir_interpolator/active]
connect_bd_net [get_bd_pins cpack/fifo_wr_overflow] [get_bd_pins axi_ad9361/adc_dovf]
connect_bd_net [get_bd_pins axi_gpio_power/gpio_io_o] [get_bd_ports powerctrl]
connect_bd_net [get_bd_pins axi_ad9361_adc_dma/irq] [get_bd_pins sys_concat_intc/In13]
connect_bd_net [get_bd_pins axi_ad9361_dac_dma/irq] [get_bd_pins sys_concat_intc/In12]
connect_bd_net [get_bd_pins axi_spi/ip2intc_irpt] [get_bd_pins sys_concat_intc/In11]

# ---- address map ----
assign_bd_address -offset 0x00000000 -range 1G -target_address_space [get_bd_addr_spaces axi_ad9361_adc_dma/m_dest_axi] [get_bd_addr_segs sys_ps7/S_AXI_HP1/HP1_DDR_LOWOCM]
assign_bd_address -offset 0x00000000 -range 1G -target_address_space [get_bd_addr_spaces axi_ad9361_dac_dma/m_src_axi] [get_bd_addr_segs sys_ps7/S_AXI_HP2/HP2_DDR_LOWOCM]
assign_bd_address -offset 0x41200000 -range 4K -target_address_space [get_bd_addr_spaces sys_ps7/Data] [get_bd_addr_segs axi_gpio_power/S_AXI/Reg]
assign_bd_address -offset 0x41600000 -range 4K -target_address_space [get_bd_addr_spaces sys_ps7/Data] [get_bd_addr_segs axi_iic_main/S_AXI/Reg]
assign_bd_address -offset 0x79020000 -range 64K -target_address_space [get_bd_addr_spaces sys_ps7/Data] [get_bd_addr_segs axi_ad9361/s_axi/axi_lite]
assign_bd_address -offset 0x7C400000 -range 4K -target_address_space [get_bd_addr_spaces sys_ps7/Data] [get_bd_addr_segs axi_ad9361_adc_dma/s_axi/axi_lite]
assign_bd_address -offset 0x7C420000 -range 4K -target_address_space [get_bd_addr_spaces sys_ps7/Data] [get_bd_addr_segs axi_ad9361_dac_dma/s_axi/axi_lite]
assign_bd_address -offset 0x7C430000 -range 4K -target_address_space [get_bd_addr_spaces sys_ps7/Data] [get_bd_addr_segs axi_spi/AXI_LITE/Reg]

validate_bd_design
save_bd_design
